# EAGLE design chibasai_board (EAGLE 9.6.2)
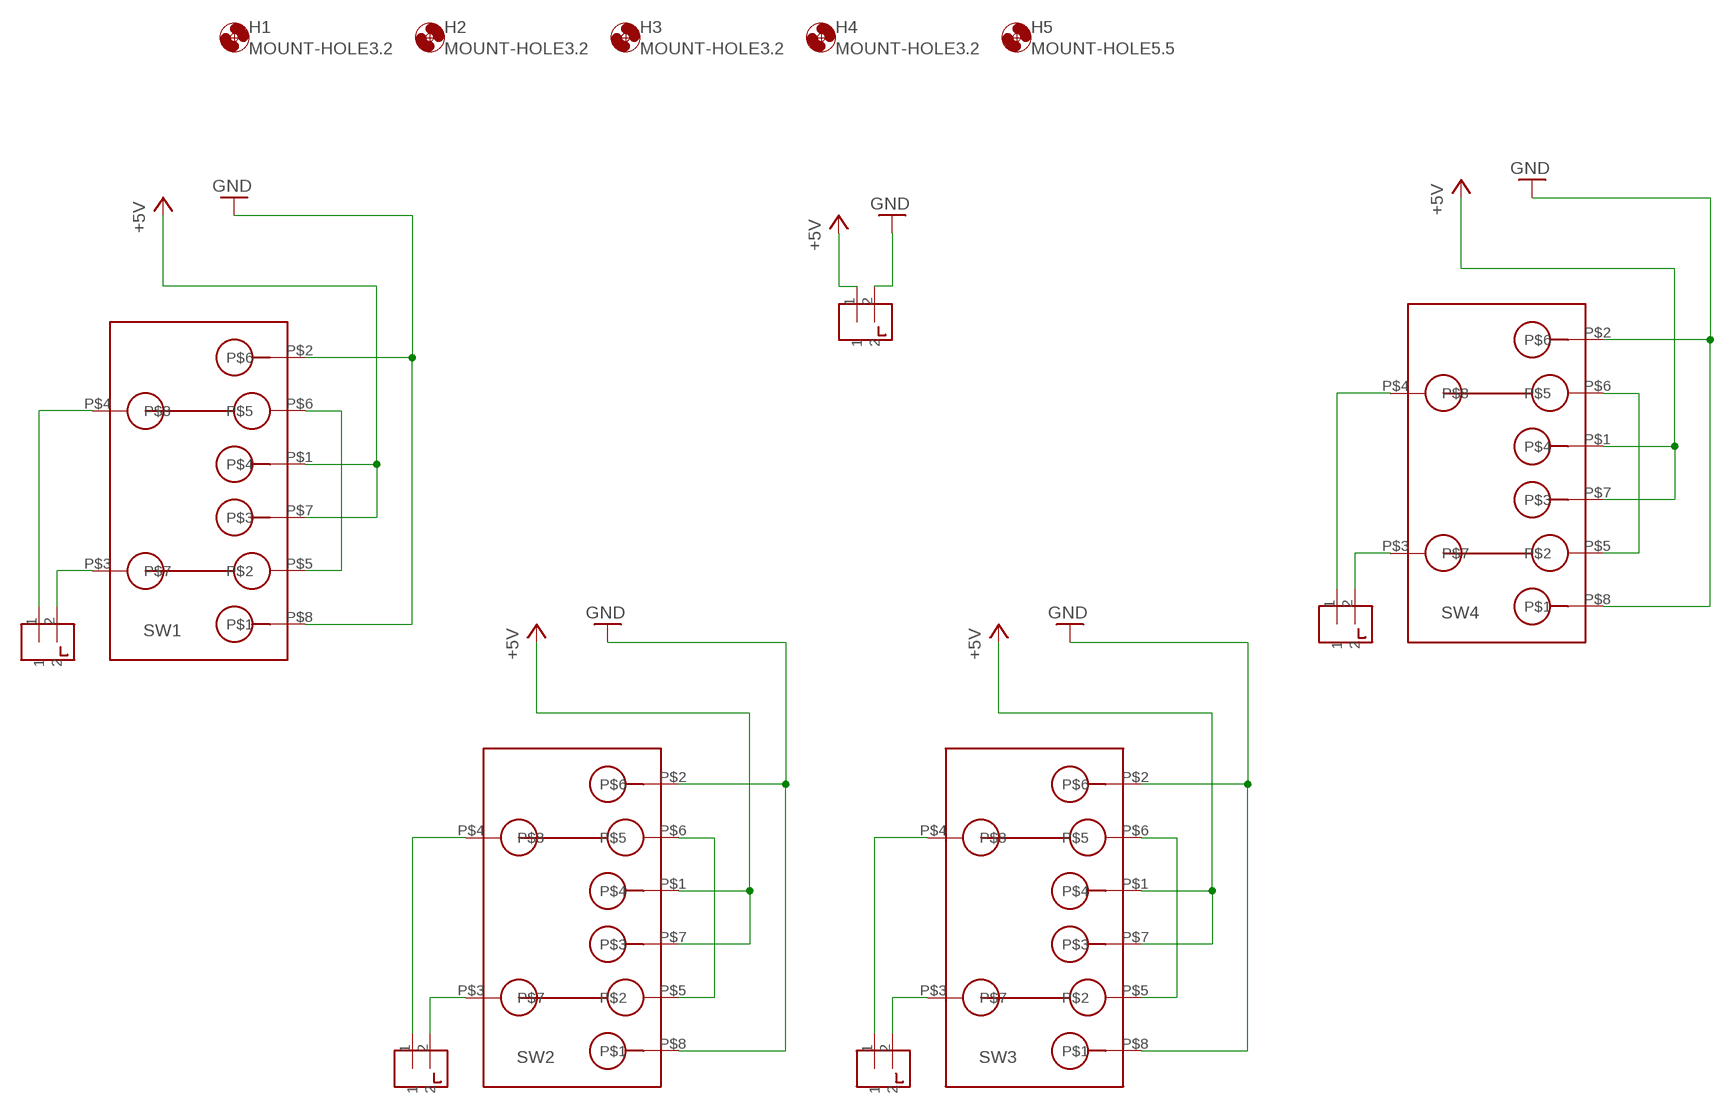
[diagram p0: schematic, sheet 1]

## Parts
CONNECTOR1  2PIN  [2PIN]
CONNECTOR2  2PIN  [2PIN]
CONNECTOR3  2PIN  [2PIN]
CONNECTOR4  2PIN  [2PIN]
CONNECTOR5  2PIN  [2PIN]
H1  MOUNT-HOLE3.2  [3,2]
H2  MOUNT-HOLE3.2  [3,2]
H3  MOUNT-HOLE3.2  [3,2]
H4  MOUNT-HOLE3.2  [3,2]
H5  MOUNT-HOLE5.5  [5,5]
SW1  ちばロボのSW  [SWのフートプリント]
SW2  ちばロボのSW  [SWのフートプリント]
SW3  ちばロボのSW  [SWのフートプリント]
SW4  ちばロボのSW  [SWのフートプリント]

## Nets
+5V: CONNECTOR5.1 SW1.P$1 SW1.P$7 SW2.P$1 SW2.P$7 SW3.P$1 SW3.P$7 SW4.P$1 SW4.P$7
GND: CONNECTOR5.2 SW1.P$2 SW1.P$8 SW2.P$2 SW2.P$8 SW3.P$2 SW3.P$8 SW4.P$2 SW4.P$8
N$1: SW1.P$5 SW1.P$6
N$2: SW2.P$5 SW2.P$6
N$3: SW3.P$5 SW3.P$6
N$4: SW4.P$5 SW4.P$6
N$5: CONNECTOR1.1 SW1.P$4
N$6: CONNECTOR1.2 SW1.P$3
N$7: CONNECTOR2.1 SW2.P$4
N$8: CONNECTOR2.2 SW2.P$3
N$9: CONNECTOR3.1 SW3.P$4
N$10: CONNECTOR3.2 SW3.P$3
N$11: CONNECTOR4.1 SW4.P$4
N$12: CONNECTOR4.2 SW4.P$3

## Library data of the parts
CONNECTOR1-CONNECTOR5 = 2pin_large:2PIN: 2pin
H1-H5 = holes:MOUNT-HOLE: MOUNTING HOLE with drill center marker
SW1-SW4 = ちばサイのすいっち　:ちばロボのSW

## Net classes
0 default: width 1.27 mm, clearance 0.381 mm

## Board
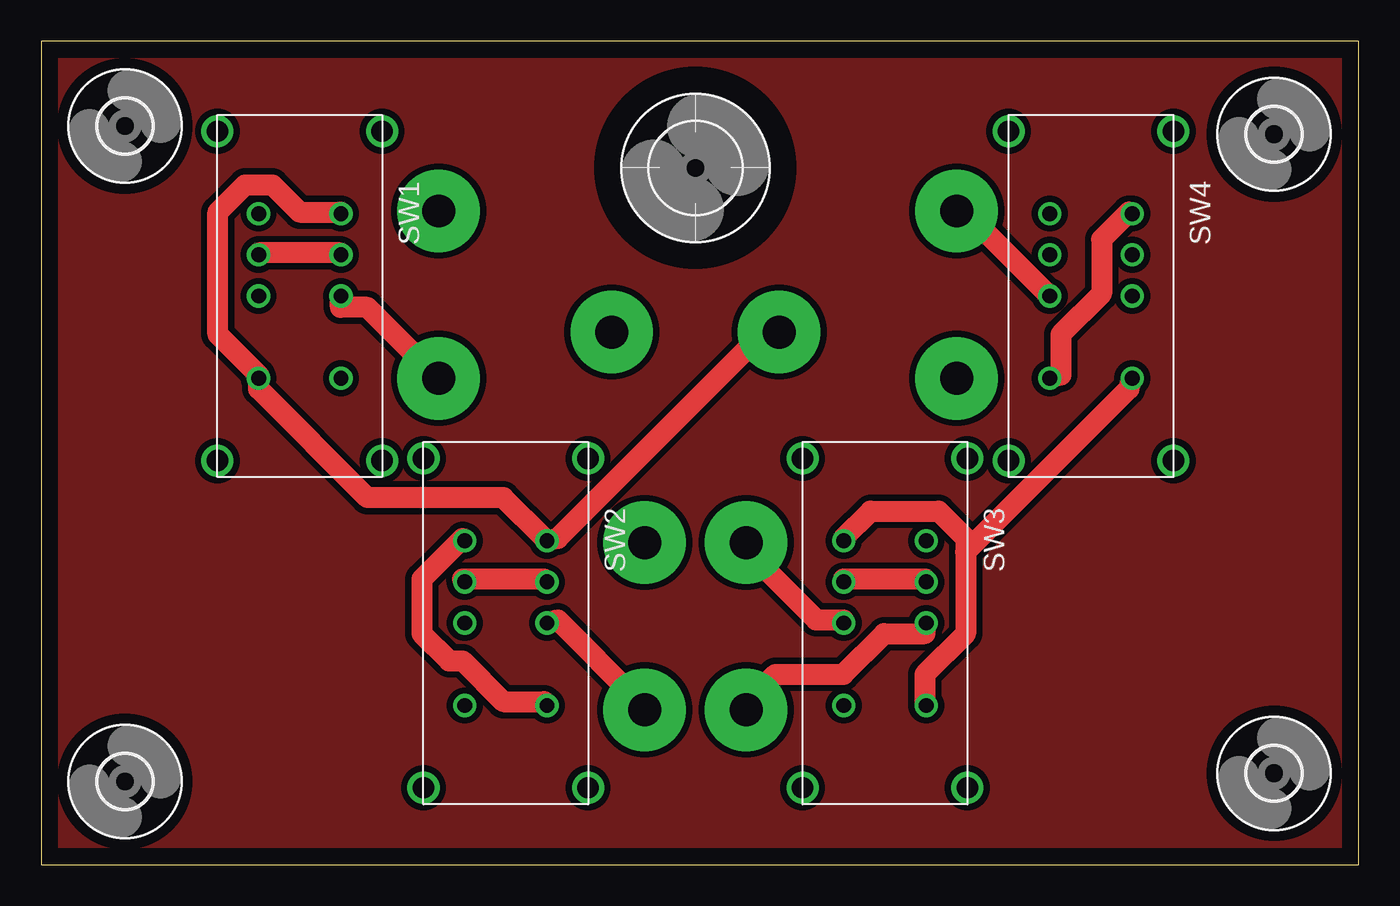
[diagram p1: board, top side]
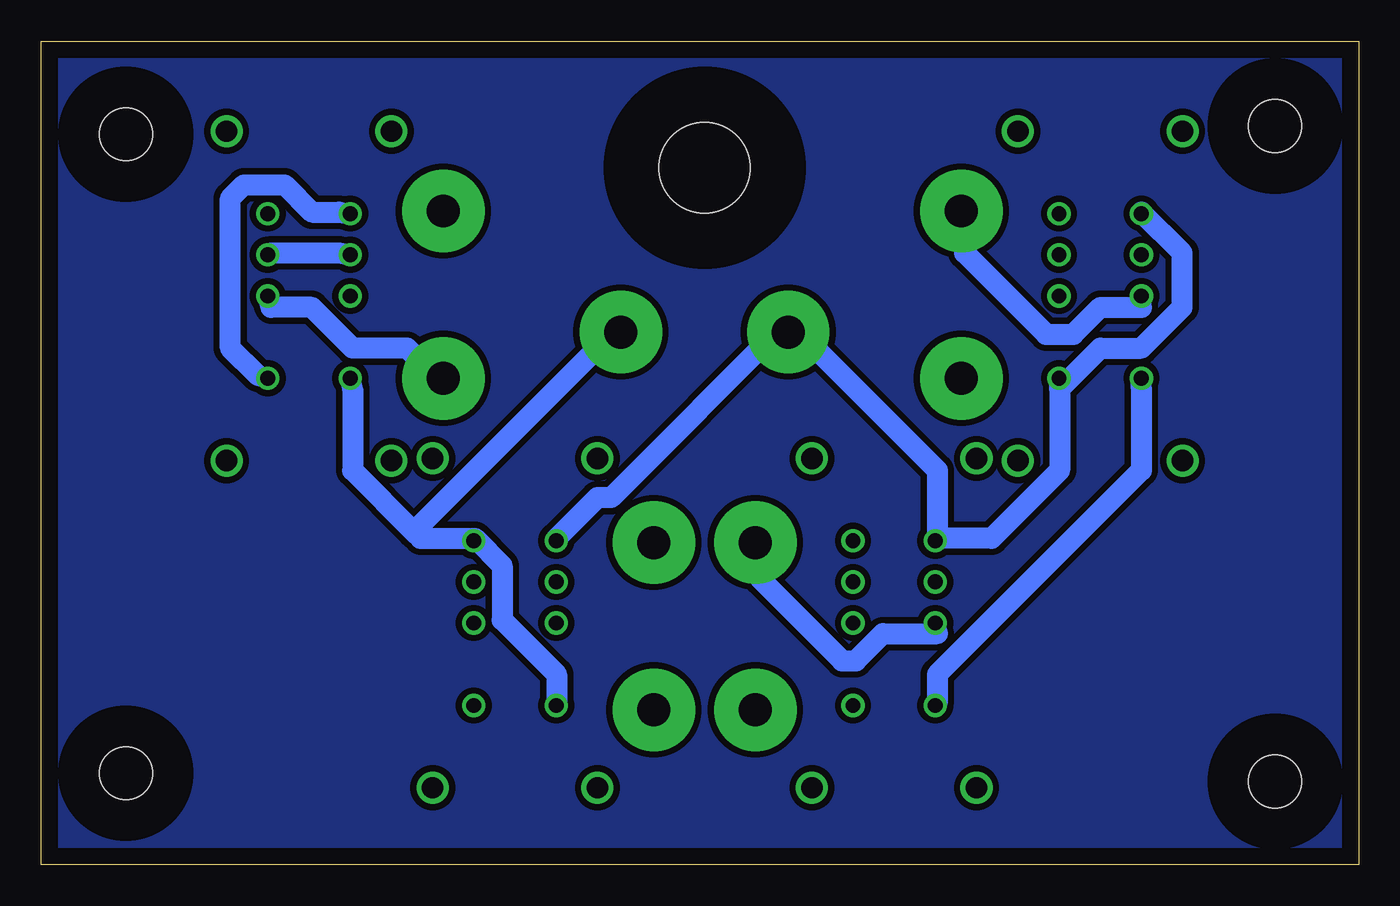
[diagram p2: board, bottom side, seen from below]

Size 80 x 50 mm. Coordinates in mm from the lower left corner, seen from the top.
Outline: 0,0 80,0 80,50 0,50 0,0
Copper layers (1*16): Top 0.035mm / dielectric 1.5mm / Bottom 0.035mm
Design rules "default": minimum track width 6mil, minimum drill 0.35mm, track to track 6mil, track to pad 6mil, pad to pad 6mil, via to via 6mil, smd to smd 6mil, copper to edge 40mil, drill to drill 6mil, minimum pad ring 10mil, minimum via ring 8mil, stop-mask expansion 4mil, vias tented up to drill 0mil, thermal gap 10mil

### Footprints (pad centres in the part's own frame; a part is rotated, then mirrored left to right if it is on the bottom)
2PIN = drill 2 pad 5: 1 0,0; 2 10.16,0
3,2 = hole 3.2: 0,0
5,5 = hole 5.5: 0,0
SWのフートプリント = drill 0.9: P$1 0,2.5; P$2 0,-2.5; P$3 -5,2.5; P$4 -5,-2.5; P$5 -7.5,2.5; P$6 -7.5,-2.5; P$7 -10,-2.5; P$8 -10,2.5 | drill 1.3: P$9 -15,5; P$10 -15,-5; P$11 5,-5; P$12 5,5

### Placement (x,y rotation side)
CONNECTOR1  24.13,39.69 270 top
CONNECTOR2  36.64,19.56 270 top
CONNECTOR3  42.8,19.56 270 top
CONNECTOR4  55.58,39.69 270 top
CONNECTOR5  34.64,32.34 0 top
H1  5.08,44.85 0 top
H2  74.86,44.35 0 top
H3  5.08,5.05 0 top
H4  74.86,5.55 0 top
H5  39.72,42.31 0 top
SW1  15.7,29.53 270 top
SW2  28.21,9.67 270 top
SW3  51.23,9.67 270 top
SW4  63.74,29.53 270 top

### Tracks (layer width: path | path; a pad name or v marks a point on that pad's centre or on a via)
+5V
  Top 1.27: SW2.P$1 30.54,9.91 28.07,9.91 25.59,12.38 24.77,12.38 23.11,14.03 23.11,17.34 25.59,19.81 SW2.P$7 | 56.13,18.99 56.13,19.81 54.48,21.46 50.35,21.46 48.7,19.81 SW3.P$7 | 56.13,18.99 56.13,14.03 53.66,11.56 53.66,9.91 SW3.P$1 | 56.13,18.99 66.04,28.89 SW4.P$1
  Bottom 1.27: 25.59,19.81 22.29,19.81 18.16,23.94 18.16,28.89 | 18.16,28.89 15.68,31.37 13.21,31.37 10.73,33.85 10.73,37.15 13.21,39.62 SW1.P$7 | 18.16,28.89 SW1.P$1 | SW3.P$7 48.7,19.81 46.23,22.29 45.4,22.29 34.67,33.02 CONNECTOR5.1 33.85,32.19 25.59,23.94 25.59,19.81 | SW4.P$7 61.91,39.62 63.56,39.62 65.22,41.27 67.69,41.27 68.52,40.45 68.52,31.37 66.86,29.72 SW4.P$1 | 25.59,19.81 SW2.P$7
AAA
  pour Bottom (isolate 0.04): 0,0 80,0 80,50 0,50
  pour Top (isolate 0.04): 0,0 80,0 80,50 0,50
GND
  Top 1.27: SW1.P$8 18.16,39.62 15.68,39.62 14.03,41.27 12.38,41.27 10.73,39.62 10.73,32.19 13.21,29.72 SW1.P$2 13.21,28.89 19.81,22.29 28.07,22.29 30.54,19.81 SW2.P$8 31.37,19.81 44.58,33.02 CONNECTOR5.2 | SW4.P$2 61.91,29.72 61.91,32.19 64.39,34.67 64.39,37.97 66.04,39.62 SW4.P$8
  Bottom 1.27: SW2.P$2 25.59,9.91 25.59,11.56 13.21,23.94 13.21,28.89 SW1.P$2 | 53.66,19.81 52.01,18.16 52.01,14.86 48.7,11.56 48.7,9.91 SW3.P$2 | 53.66,19.81 56.96,19.81 57.37,20.23 | 57.37,20.23 61.09,23.94 61.09,28.89 SW4.P$2 | 53.66,19.81 SW3.P$8 | 57.37,20.23 45.4,32.19 CONNECTOR5.2
N$1
  Top 1.27: SW1.P$6 13.21,37.15 18.16,37.15 SW1.P$5
N$2
  Top 1.27: SW2.P$6 25.59,17.34 30.54,17.34 SW2.P$5
N$3
  Top 1.27: SW3.P$6 48.7,17.34 53.66,17.34 SW3.P$5
N$4
  Bottom 1.27: SW4.P$6 61.91,37.15 66.04,37.15 SW4.P$5
N$5
  Bottom 1.27: SW1.P$4 13.21,33.85 15.68,33.85 17.34,32.19 18.99,32.19 23.94,37.15 23.94,39.62 CONNECTOR1.1
N$6
  Top 1.27: SW1.P$3 18.16,33.85 19.81,33.85 23.94,29.72 CONNECTOR1.2
N$7
  Bottom 1.27: SW2.P$4 25.59,14.03 28.89,14.03 30.54,12.38 31.37,12.38 36.32,17.34 36.32,18.99 CONNECTOR2.1
N$8
  Top 1.27: SW2.P$3 31.37,14.86 36.32,9.91 CONNECTOR2.2
N$9
  Top 1.27: SW3.P$4 48.7,14.86 47.05,14.86 42.93,18.99 CONNECTOR3.1
N$10
  Top 1.27: SW3.P$3 53.66,14.03 51.18,14.03 48.7,11.56 44.58,11.56 42.93,9.91 CONNECTOR3.2
N$11
  Top 1.27: SW4.P$4 61.09,34.67 56.13,39.62 CONNECTOR4.1
N$12
  Bottom 1.27: SW4.P$3 66.04,33.85 63.56,33.85 61.09,31.37 57.78,31.37 56.13,29.72 CONNECTOR4.2